# Altium schematic sheet 3_cyber60-alps_mcu.SchDoc: =ProjectTitle
size A3; Address1: github.com/4pplet/cyber60; Address2: Licence: CERN-OHL-S; SheetNumber: 3; SheetTotal: 5
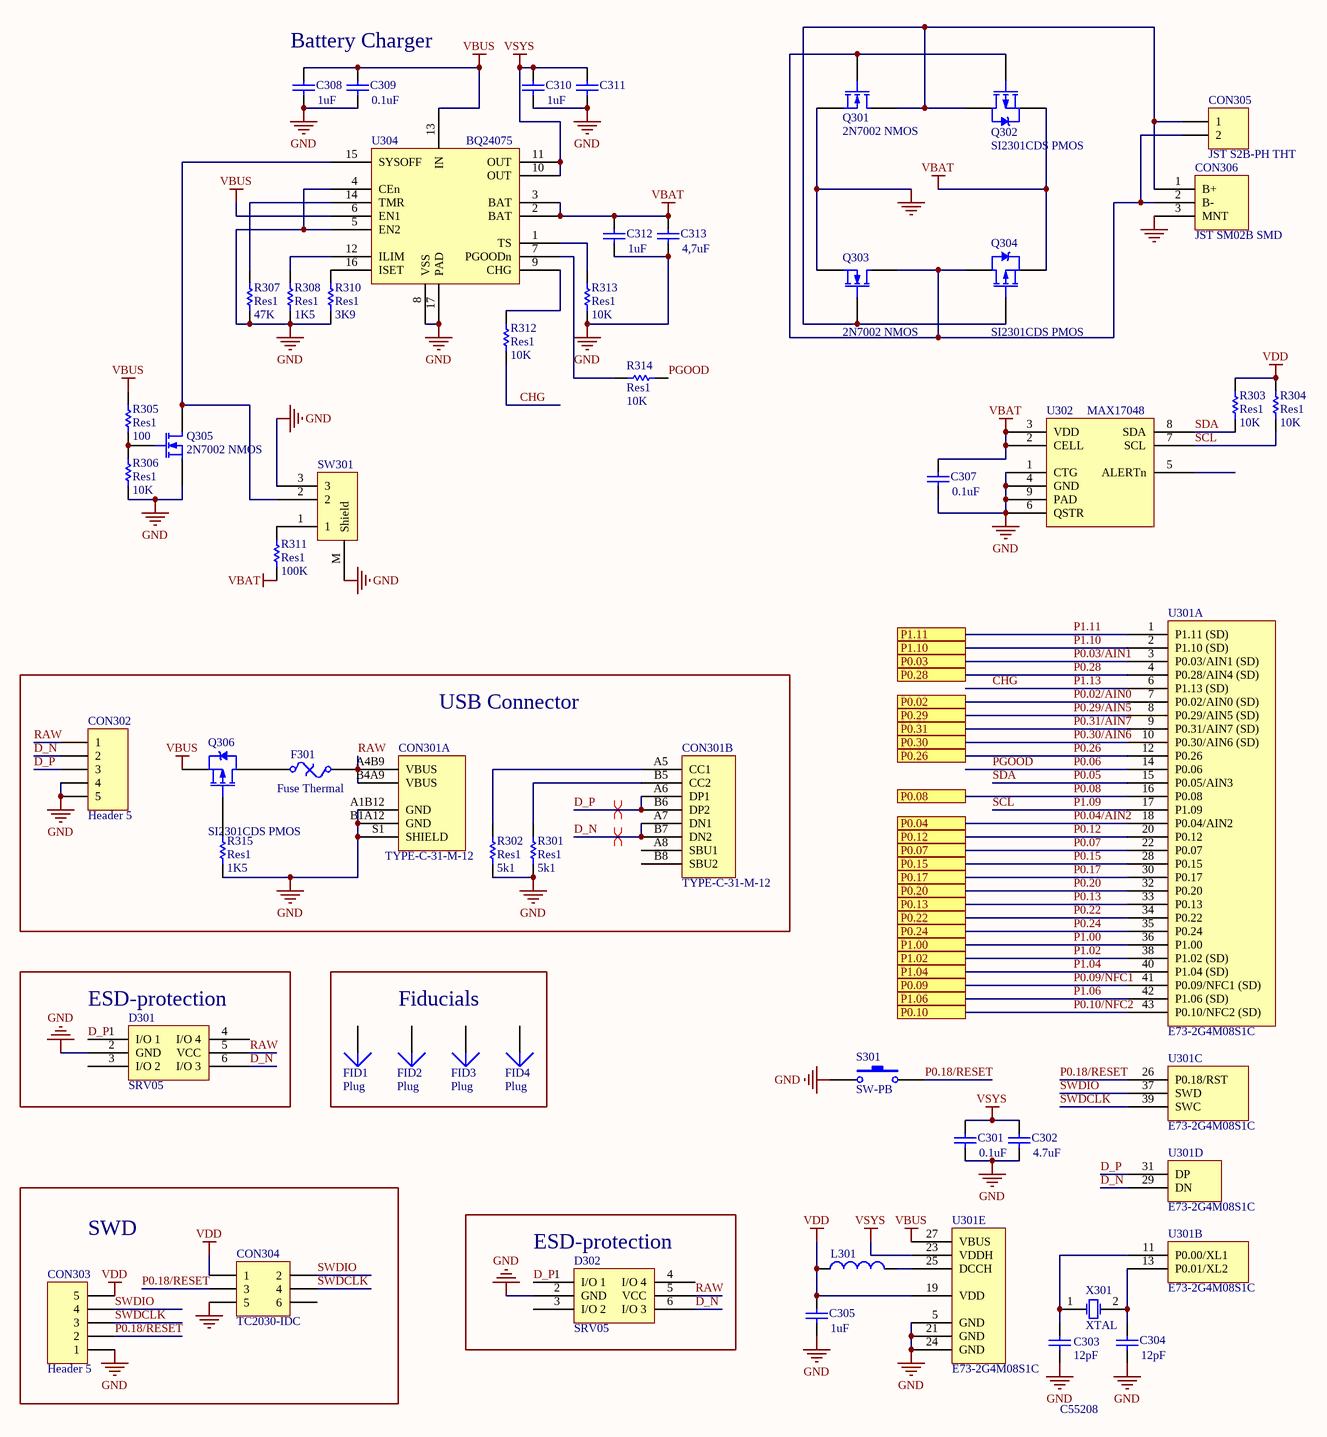
[diagram p0: 3_cyber60-alps_mcu.SchDoc]

## Parts
C301  value 0.1uF  [C0603[1608]]
C302  value 4.7uF  [C0603[1608]]
C303  value 12pF  [C0402[1005]]
C304  value 12pF  [C0402[1005]]
C305  value 1uF  [C0603[1608]]
C307  value 0.1uF  [C0603[1608]]
C308  value 1uF  [C0603[1608]]
C309  value 0.1uF  [C0603[1608]]
C310  value 1uF  [C0603[1608]]
C311  (no value)  [C0603[1608]]
C312  value 1uF  [C0603[1608]]
C313  value 4,7uF  [C0603[1608]]
CON301  TYPE-C-31-M-12  [TYPE-C-31-M-12]  (parts A,B of 2)
CON302  Header 5  [UDB_COMBO_JST_MOLEX]
CON303  Header 5  [HDR1X5]  (no BOM)
CON304  TC2030-IDC  [TC2030-IDC-NL]  (no BOM)
CON305  JST S2B-PH THT  [JST S2B-PH-K(LF)(SN)]  (no BOM)
CON306  JST SM02B SMD  [JST SM02B-SRSS-TB]
D301  SRV05  [SOT-23-6]
D302  SRV05  [SOT-23-6]
F301  Fuse Thermal  [C1206[3216]]
FID1  Plug  [Fiducial_Nordic]  (no BOM)
FID2  Plug  [Fiducial_Nordic]  (no BOM)
FID3  Plug  [Fiducial_Nordic]  (no BOM)
FID4  Plug  [Fiducial_Nordic]  (no BOM)
L301  Inductor  [L0603[1608]]  (value not drawn)
Q301  2N7002 NMOS  [SOT-23-3]
Q302  SI2301CDS PMOS  [SOT-23-3]
Q303  2N7002 NMOS  [SOT-23-3]
Q304  SI2301CDS PMOS  [SOT-23-3]
Q305  2N7002 NMOS  [SOT-23-3]
Q306  SI2301CDS PMOS  [SOT-23-3]
R301  Res1  value 5k1  [R0603[1608]]
R302  Res1  value 5k1  [R0603[1608]]
R303  Res1  value 10K  [R0603[1608]]
R304  Res1  value 10K  [R0603[1608]]
R305  Res1  value 100  [R0603[1608]]
R306  Res1  value 10K  [R0603[1608]]
R307  Res1  value 47K  [R0603[1608]]
R308  Res1  value 1K5  [R0603[1608]]
R310  Res1  value 3K9  [R0603[1608]]
R311  Res1  value 100K  [R0603[1608]]
R312  Res1  value 10K  [R0603[1608]]
R313  Res1  value 10K  [R0603[1608]]
R314  Res1  value 10K  [R0603[1608]]
R315  Res1  value 1K5  [R0603[1608]]
S301  SW-PB  [XKB Switch]
SW301  Korean Hroparts Elec K3-1296S-E2  [Korean Hroparts Elec K3-1296S-E2]  (value not drawn)
U301  E73-2G4M08S1C  [E73-2G4M08S1C]  (parts A,B,C,D,E of 5)
U302  MAX17048  [8TDFN]
U304  BQ24075  [QFN16]
X301  XTAL  [XTAL-2012]

## Blocks framed on the sheet
USB Connector: CON301 CON302 F301 Q306 R301 R302 R315
ESD-protection: D301
Fiducials: FID1-FID4
SWD: CON303 CON304
ESD-protection: D302

## Ports
P0.02, P0.03, P0.04, P0.07, P0.08, P0.09, P0.10, P0.12, P0.13, P0.15, P0.17, P0.20, P0.22, P0.24, P0.26, P0.28, P0.29, P0.30, P0.31, P1.00, P1.02, P1.04, P1.06, P1.10, P1.11

## Nets
GND: C301.1 C302.1 C303.1 C304.1 C305.1 C307.1 C308.1 C309.1 C310.1 C311.1 C312.1 C313.1 CON301.A1B12(GND) CON301.B1A12(GND) CON301.S1(SHIELD) CON302.4 CON302.5 CON303.1 CON304.5 CON306.3(MNT) D301.2(GND) D302.2(GND) Q301.2(S) Q303.2(S) Q305.2(S) R301.2 R302.2 R306.2 R307.2 R308.2 R310.2 R313.2 R315.2 S301.1 SW301.3 SW301.M(Shield) U301.5(GND) U301.21(GND) U301.24(GND) U302.1(CTG) U302.4(GND) U302.6(QSTR) U302.9(PAD) U304.4(CEn) U304.5(EN2) U304.8(VSS) U304.17(PAD)
VBAT: C307.2 C312.2 C313.2 Q302.2(S) Q304.2(S) R311.2 U302.2(CELL) U302.3(VDD) U304.2(BAT) U304.3(BAT)
VBUS: C308.2 C309.2 Q306.2(S) R305.1 U301.27(VBUS) U304.6(EN1) U304.13(IN)
VDD: C305.2 CON303.5 CON304.1 L301.1 R303.1 R304.1 U301.19(VDD)
VSYS: C301.2 C302.2 C310.2 C311.2 U301.23(VDDH) U304.10(OUT) U304.11(OUT)
CHG: R312.2 U301.6(P1.13_(SD))  [also labelled P1.13]
D_N: CON301.A7(DN1) CON301.B7(DN2) CON302.2 D301.6(I/O_3) D302.6(I/O_3) U301.29(DN)
D_P: CON301.A6(DP1) CON301.B6(DP2) CON302.3 D301.1(I/O_1) D302.1(I/O_1) U301.31(DP)
P0.02/AIN0: U301.7(P0.02/AIN0_(SD)) ; port P0.02
P0.03/AIN1: U301.3(P0.03/AIN1_(SD)) ; port P0.03
P0.04/AIN2: U301.18(P0.04/AIN2) ; port P0.04
P0.05: R303.2 U301.15(P0.05/AIN3) U302.8(SDA)  [also labelled SDA]
P0.06: R314.2 U301.14(P0.06)  [also labelled PGOOD]
P0.07: U301.22(P0.07) ; port P0.07
P0.08: U301.16(P0.08) ; port P0.08
P0.09/NFC1: U301.41(P0.09/NFC1_(SD)) ; port P0.09
P0.10/NFC2: U301.43(P0.10/NFC2_(SD)) ; port P0.10
P0.12: U301.20(P0.12) ; port P0.12
P0.13: U301.33(P0.13) ; port P0.13
P0.15: U301.28(P0.15) ; port P0.15
P0.17: U301.30(P0.17) ; port P0.17
P0.18/RESET: CON303.2 CON304.3 S301.2 U301.26(P0.18/RST)
P0.20: U301.32(P0.20) ; port P0.20
P0.22: U301.34(P0.22) ; port P0.22
P0.24: U301.35(P0.24) ; port P0.24
P0.26: U301.12(P0.26) ; port P0.26
P0.28: U301.4(P0.28/AIN4_(SD)) ; port P0.28
P0.29/AIN5: U301.8(P0.29/AIN5_(SD)) ; port P0.29
P0.30/AIN6: U301.10(P0.30/AIN6_(SD)) ; port P0.30
P0.31/AIN7: U301.9(P0.31/AIN7_(SD)) ; port P0.31
P1.00: U301.36(P1.00) ; port P1.00
P1.02: U301.38(P1.02_(SD)) ; port P1.02
P1.04: U301.40(P1.04_(SD)) ; port P1.04
P1.06: U301.42(P1.06_(SD)) ; port P1.06
P1.09: R304.2 U301.17(P1.09) U302.7(SCL)  [also labelled SCL]
P1.10: U301.2(P1.10_(SD)) ; port P1.10
P1.11: U301.1(P1.11_(SD)) ; port P1.11
RAW: CON301.A4B9(VBUS) CON301.B4A9(VBUS) CON302.1 D301.5(VCC) D302.5(VCC) F301.2
SWDCLK: CON303.3 CON304.4 U301.39(SWC)
SWDIO: CON303.4 CON304.2 U301.37(SWD)
NetC303_2: C303.2 U301.11(P0.00/XL1) X301.1(OSC1)
NetC304_2: C304.2 U301.13(P0.01/XL2) X301.2(OSC2)
NetCON301_A5: CON301.A5(CC1) R302.1
NetCON301_B5: CON301.B5(CC2) R301.1
NetCON305_1: CON305.1 CON306.1(B+) Q301.3(D) Q302.3(D) Q303.1(G) Q304.1(G)
NetCON305_2: CON305.2 CON306.2(B-) Q301.1(G) Q302.1(G) Q303.3(D) Q304.3(D)
NetF301_1: F301.1 Q306.3(D)
NetL301_2: L301.2 U301.25(DCCH)
NetQ305_1: Q305.1(G) R305.2 R306.1
NetQ305_3: Q305.3(D) SW301.2 U304.15(SYSOFF)
NetQ306_1: Q306.1(G) R315.1
NetR307_1: R307.1 U304.14(TMR)
NetR308_1: R308.1 U304.12(ILIM)
NetR310_1: R310.1 U304.16(ISET)
NetR311_1: R311.1 SW301.1
NetR312_1: R312.1 U304.9(CHG)
NetR313_1: R313.1 U304.1(TS)
NetR314_1: R314.1 U304.7(PGOODn)

Not connected (* = marked no-connect by the designer): CON301 A8(SBU1) B8(SBU2); CON304 6; D301 3(I/O_2) 4(I/O_4); D302 3(I/O_2) 4(I/O_4); FID1 1; FID2 1; FID3 1; FID4 1; U302 5(ALERTn)

## Layout directives
differential pair: D_N, D_P

## Notes on the sheet
- Battery Charger
- C55208
- Title
- Size:
- Date:
- File:
- A0
- Number:
- Time:
- Revision:
- Sheet
- of

## Library data of the parts
C301 C307 C309 = Cap: Capacitor; MRF.Part: CC0603KRX7R9BB104; LCSC MFG: YAGEO; Version: 0603 imperial; LCSC Part #: C14663
C302 C311 C313 = Cap: Capacitor; MRF.Part: CL10A475KO8NNNC; LCSC MFG: Samsung Electro-Mechanics; LCSC Part #: C19666
  C302: Version: 0603 imperial
C303 C304 = Cap: Capacitor; MRF.Part: 0402CG120J500NT; LCSC MFG: FH (Guangdong Fenghua Advanced Tech); Version: 0402; LCSC Part #: C1547
C305 C308 C310 C312 = Cap: Capacitor; MRF.Part: CL10A105KB8NNNC; LCSC MFG: Samsung Electro-Mechanics; Version: 0603 imperial; LCSC Part #: C15849
CON301 = TYPE-C-31-M-12: MFG: Korean Hroparts Elec; MFGPN: TYPE-C-31-M-12; LCSC Part #: C165948; LCSC MFG: Korean Hroparts Elec; MRF.Part: TYPE-C-31-M-12
CON302 = Header 5: JST for USB daughter board; MFGPN: SM04B-SRSS-TB(LF)(SN); MFG: JST Sales America Inc.; LCSC MFG: JST Sales America; LCSC Part #: C160404; MRF.Part: SM04B-SRSS-TB(LF)(SN)
CON303 = Header 5: Header, 5-Pin
CON304 = Header 3X2: Header, 3-Pin, Dual row
CON305 = Header 2: Header, 2-Pin; MRF.Part: S2B-PH-K(LF)(SN); LCSC MFG: JST Sales America; LCSC Part #: C265016
CON306 = JST S2B-PH-SM4-TB: MRF.Part: SM02B-SRSS-TB(LF)(SN); LCSC MFG: JST Sales America; LCSC Part #: C160402
D301 D302 = SRV05: MRF.Part: SRV05-4-P-T7; LCSC MFG: ProTek Devices; LCSC Part #: C85364
F301 = Fuse Thermal: Thermal Fuse; MRF.Part: ASMD1206-050; MFG: Bel Fuse Inc.; MFGPN: 0ZCJ0050FF2G; LCSC MFG: Shenzhen JDT Fuse; LCSC Part #: C135338
L301 = Inductor: MRF.Part: CBMF1608T100K; LCSC MFG: Taiyo Yuden; LCSC Part #: C92982
Q301 Q303 Q305 = MOSFET-N: N-Channel MOSFET; LCSC MFG: Changjiang Electronics Tech (CJ); LCSC Part #: C8545; MRF.Part: 2N7002
Q302 Q304 Q306 = PMOS-2: P-Channel Power MOSFET; MRF.Part: SI2301CDS-T1-GE3; Note: Pin 4 not drawn and electrically connected to Pin 2.; LCSC MFG: Vishay Intertech; LCSC Part #: C10487
R301 R302 = Res1: Resistor; MRF.Part: 0603WAF5101T5E; MFG: Panasonic Electronic Components; MFGPN: ERJ-3EKF5101V; LCSC MFG: Uniroyal Elec; Version: 0603 imperial; LCSC Part #: C23186
R303 R304 R306 R311-R314 = Res1: Resistor; MRF.Part: 0603WAF1002T5E; LCSC MFG: Uniroyal Elec; Version: 0603 imperial; LCSC Part #: C25804
R305 = Res1: Resistor; MRF.Part: 0603WAF1000T5E; LCSC MFG: UNI-ROYAL(Uniroyal Elec); Version: 0603 imperial; LCSC Part #: C22775
R307 = Res1: Resistor; MRF.Part: 0603WAF4702T5E; LCSC MFG: UNI-ROYAL(Uniroyal Elec); Version: 0603 imperial; LCSC Part #: C25819
R308 R315 = Res1: Resistor; MRF.Part: 0603WAF1501T5E; LCSC MFG: UNI-ROYAL(Uniroyal Elec); Version: 0603 imperial; LCSC Part #: C22843
R310 = Res1: Resistor; MRF.Part: 0603WAF3901T5E; LCSC MFG: UNI-ROYAL(Uniroyal Elec); Version: 0603 imperial; LCSC Part #: C23018
S301 = SW-PB: Switch; MRF.Part: TS-1187A-C-D-B; LCSC MFG: XKB Enterprise; LCSC Part #: C318888
U301 = E73-2G4M08S1C: LCSC MFG: Chengdu Ebyte Elec Tech; LCSC Part #: C356849; MRF.Part: E73-2G4M08S1C
U302 = MAX17048: MRF.Part: MAX17048G+T10; LCSC MFG: Analog Devices Inc./Maxim Integrated; LCSC Part #: C2682616
U304 = BQ24075: MRF.Part: BQ24075RGTR; LCSC MFG: Texas Instruments; LCSC Part #: C15464
X301 = XTAL: Crystal Oscillator; MRF.Part: X1A0000610002; Value: 32.768KHz; LCSC MFG: Seiko Epson; Version: 3225, 18pF; LCSC Part #: C55208
SW301 = Korean Hroparts Elec K3-1296S-E2: LCSC MFG: Korean Hroparts Elec; LCSC Part #: C136659; MFGPN: K3-1296S-E2